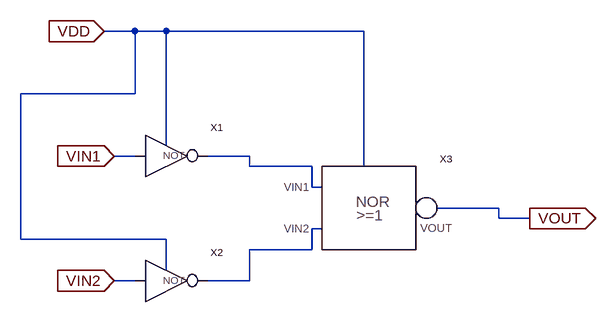
[diagram p0: schematic and.asc]
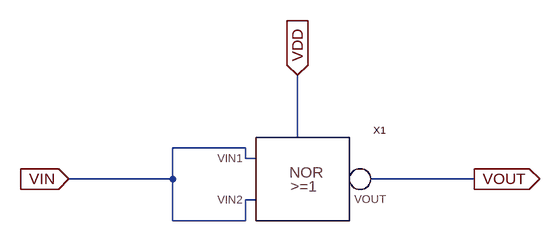
[diagram p1: sub-circuit not.asc]
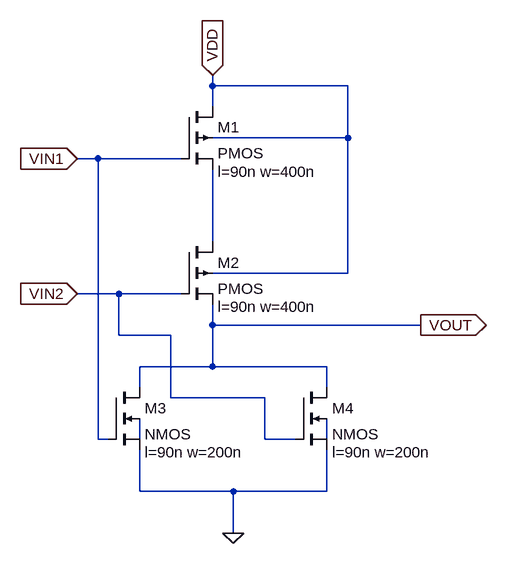
[diagram p2: sub-circuit nor.asc]
and.asc, the LTspice schematic file:
Version 4
SHEET 1 880 680
WIRE 64 -96 16 -96
WIRE 112 -96 64 -96
WIRE 416 -96 112 -96
WIRE 64 0 64 -96
WIRE 64 0 -112 0
WIRE 112 80 112 -96
WIRE 80 96 32 96
WIRE 240 96 160 96
WIRE 240 112 240 96
WIRE 336 112 240 112
WIRE 416 112 416 -96
WIRE 336 144 336 112
WIRE 352 144 336 144
WIRE 624 176 528 176
WIRE 624 192 624 176
WIRE 672 192 624 192
WIRE 352 208 336 208
WIRE -112 224 -112 0
WIRE 112 224 -112 224
WIRE 336 240 336 208
WIRE 336 240 240 240
WIRE 112 272 112 224
WIRE 80 288 32 288
WIRE 240 288 240 240
WIRE 240 288 160 288
FLAG 32 96 VIN1
IOPIN 32 96 In
FLAG 32 288 VIN2
IOPIN 32 288 In
FLAG 672 192 VOUT
IOPIN 672 192 Out
FLAG 16 -96 VDD
IOPIN 16 -96 In
SYMBOL not 96 96 R0
SYMATTR InstName X1
SYMBOL not 96 288 R0
SYMATTR InstName X2
SYMBOL nor 336 144 R0
SYMATTR InstName X3

not.asc, the sub-circuit schematic file:
Version 4
SHEET 1 880 680
WIRE 384 80 384 -16
WIRE 304 96 192 96
WIRE 304 112 304 96
WIRE 320 112 304 112
WIRE 192 144 192 96
WIRE 192 144 32 144
WIRE 656 144 496 144
WIRE 320 176 304 176
WIRE 192 208 192 144
WIRE 304 208 304 176
WIRE 304 208 192 208
FLAG 32 144 VIN
IOPIN 32 144 In
FLAG 384 -16 VDD
IOPIN 384 -16 In
FLAG 656 144 VOUT
IOPIN 656 144 Out
SYMBOL nor 304 112 R0
SYMATTR InstName X1

nor.asc, the sub-circuit schematic file:
Version 4
SHEET 1 880 680
WIRE -32 -64 -32 -80
WIRE 176 -64 -32 -64
WIRE -32 -32 -32 -64
WIRE 176 16 176 -64
WIRE 176 16 -32 16
WIRE -208 48 -240 48
WIRE -80 48 -208 48
WIRE -32 176 -32 64
WIRE 176 224 176 16
WIRE 176 224 -32 224
WIRE -176 256 -240 256
WIRE -80 256 -176 256
WIRE -32 304 -32 272
WIRE 288 304 -32 304
WIRE -176 320 -176 256
WIRE -96 320 -176 320
WIRE -32 368 -32 304
WIRE -32 368 -144 368
WIRE 144 368 -32 368
WIRE -144 400 -144 368
WIRE 144 400 144 368
WIRE -96 416 -96 320
WIRE 48 416 -96 416
WIRE -208 480 -208 48
WIRE -192 480 -208 480
WIRE -144 480 -144 448
WIRE 48 480 48 416
WIRE 96 480 48 480
WIRE 144 480 144 448
WIRE -144 560 -144 496
WIRE 0 560 -144 560
WIRE 144 560 144 496
WIRE 144 560 0 560
WIRE 0 624 0 560
FLAG -32 -80 VDD
IOPIN -32 -80 In
FLAG -240 48 VIN1
IOPIN -240 48 In
FLAG -240 256 VIN2
IOPIN -240 256 In
FLAG 288 304 VOUT
IOPIN 288 304 Out
FLAG 0 624 0
SYMBOL pmos4 -80 -32 R0
WINDOW 123 56 100 Left 2
SYMATTR Value2 l=90n w=400n
SYMATTR InstName M1
SYMBOL pmos4 -80 176 R0
WINDOW 123 56 100 Left 2
SYMATTR Value2 l=90n w=400n
SYMATTR InstName M2
SYMBOL nmos4 -192 400 R0
WINDOW 123 56 100 Left 2
SYMATTR Value2 l=90n w=200n
SYMATTR InstName M3
SYMBOL nmos4 96 400 R0
WINDOW 123 56 100 Left 2
SYMATTR Value2 l=90n w=200n
SYMATTR InstName M4

The netlist it stands for:
* and.asc
XX1 VIN1 N001 VDD not
XX2 VIN2 N002 VDD not
XX3 N001 N002 VOUT VDD nor

* block symbol definitions
.subckt not VIN VOUT VDD
XX1 VIN VIN VOUT VDD nor
.ends not

.subckt nor VIN1 VIN2 VOUT VDD
M1 VDD VIN1 N001 VDD PMOS l=90n w=400n
M2 N001 VIN2 VOUT VDD PMOS l=90n w=400n
M3 VOUT VIN1 0 N002 NMOS l=90n w=200n
M4 VOUT VIN2 0 N003 NMOS l=90n w=200n
.ends nor

.model NMOS NMOS
.model PMOS PMOS
.lib standard.mos
.backanno
.end